# EAGLE design SeniorDesignTest (EAGLE 7.0.0)
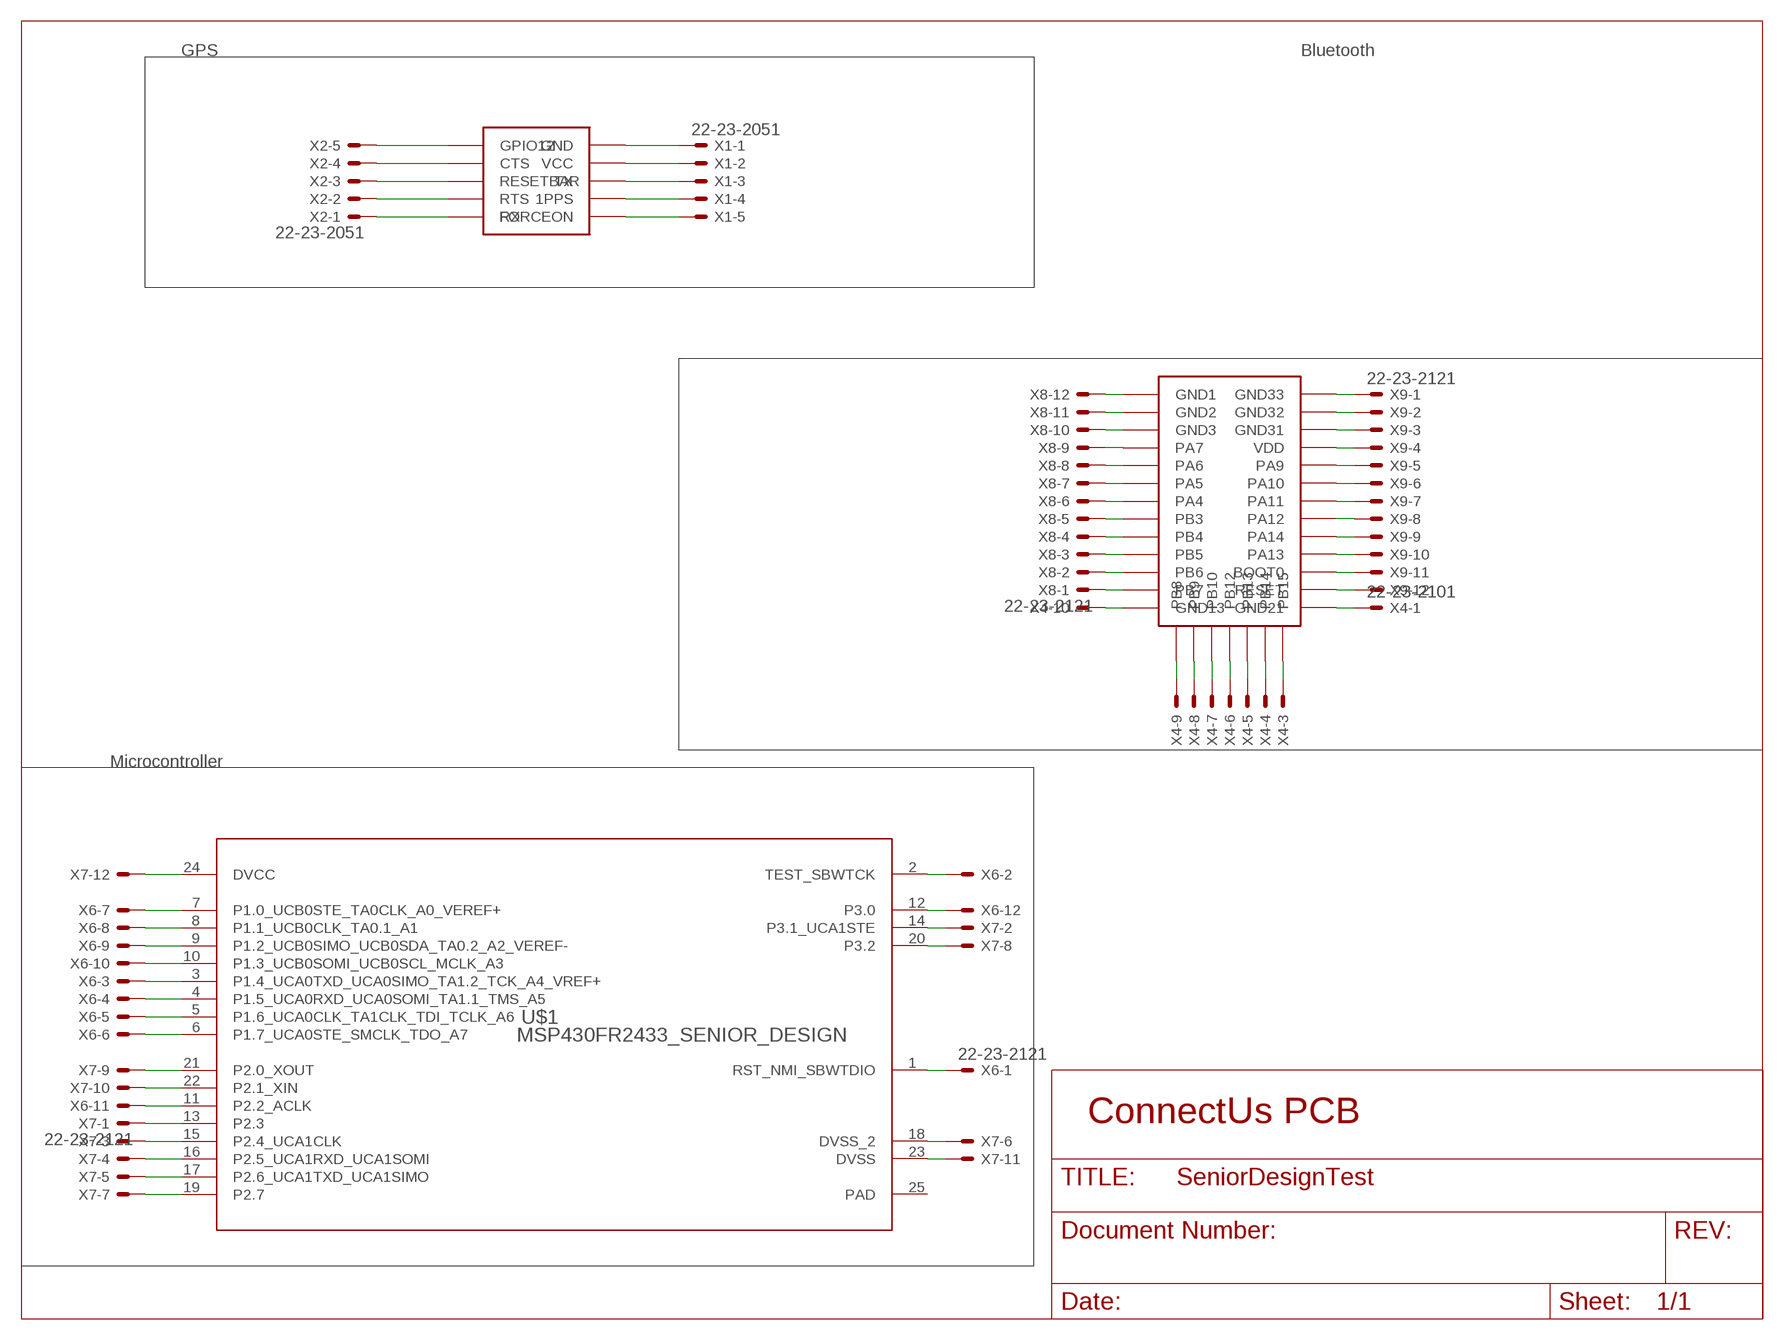
[diagram p0: schematic, sheet 1]

## Parts
GPS(ORG1510)  ORG1510  [ORG1510]
U$1  MSP430FR2433_SENIOR_DESIGN  [RGE0024G_NV]
U$2  BT121  [BT121]
X1  22-23-2051  [22-23-2051]
X2  22-23-2051  [22-23-2051]
X4  22-23-2101  [22-23-2101]
X6  22-23-2121  [22-23-2121]
X7  22-23-2121  [22-23-2121]
X8  22-23-2121  [22-23-2121]
X9  22-23-2121  [22-23-2121]

## Nets
N$1: U$1.24(DVCC) X7.12
N$2: U$1.7(P1.0_UCB0STE_TA0CLK_A0_VEREF+) X6.7
N$3: U$1.8(P1.1_UCB0CLK_TA0.1_A1) X6.8
N$4: U$1.9(P1.2_UCB0SIMO_UCB0SDA_TA0.2_A2_VEREF-) X6.9
N$5: U$2.PB3 X8.5
N$6: U$1.10(P1.3_UCB0SOMI_UCB0SCL_MCLK_A3) X6.10
N$7: U$1.3(P1.4_UCA0TXD_UCA0SIMO_TA1.2_TCK_A4_VREF+) X6.3
N$8: U$1.4(P1.5_UCA0RXD_UCA0SOMI_TA1.1_TMS_A5) X6.4
N$9: U$1.5(P1.6_UCA0CLK_TA1CLK_TDI_TCLK_A6) X6.5
N$10: U$1.6(P1.7_UCA0STE_SMCLK_TDO_A7) X6.6
N$11: U$2.PB4 X8.4
N$12: U$1.21(P2.0_XOUT) X7.9
N$13: U$1.22(P2.1_XIN) X7.10
N$14: U$1.11(P2.2_ACLK) X6.11
N$15: U$1.13(P2.3) X7.1
N$16: U$2.PB5 X8.3
N$17: U$1.15(P2.4_UCA1CLK) X7.3
N$18: U$1.16(P2.5_UCA1RXD_UCA1SOMI) X7.4
N$19: U$1.17(P2.6_UCA1TXD_UCA1SIMO) X7.5
N$20: U$1.19(P2.7) X7.7
N$21: U$1.2(TEST_SBWTCK) X6.2
N$22: U$1.12(P3.0) X6.12
N$23: U$1.14(P3.1_UCA1STE) X7.2
N$24: U$1.20(P3.2) X7.8
N$25: U$1.1(RST_NMI_SBWTDIO) X6.1
N$26: U$1.18(DVSS_2) X7.6
N$27: U$1.23(DVSS) X7.11
N$28: U$2.GND1 X8.12
N$29: U$2.GND2 X8.11
N$30: U$2.GND3 X8.10
N$31: U$2.PA7 X8.9
N$32: U$2.PA6 X8.8
N$33: U$2.PA5 X8.7
N$34: U$2.PA4 X8.6
N$35: U$2.PB6 X8.2
N$36: U$2.PB7 X8.1
N$37: U$2.GND13 X4.10
N$38: U$2.PA12 X9.8
N$39: U$2.PA14 X9.9
N$40: U$2.PA13 X9.10
N$41: U$2.GND33 X9.1
N$42: U$2.GND32 X9.2
N$43: U$2.GND31 X9.3
N$44: U$2.VDD X9.4
N$45: U$2.PA9 X9.5
N$46: U$2.PA10 X9.6
N$47: U$2.PA11 X9.7
N$48: U$2.BOOT0 X9.11
N$49: U$2.RESET X9.12
N$50: U$2.GND21 X4.1
N$54: U$2.PB8 X4.9
N$55: U$2.PB9 X4.8
N$56: U$2.PB10 X4.7
N$57: U$2.PB12 X4.6
N$58: U$2.PB13 X4.5
N$59: U$2.PB14 X4.4
N$60: U$2.PB15 X4.3
N$61: GPS(ORG1510).GPIO12 X2.5
N$62: GPS(ORG1510).CTS X2.4
N$63: GPS(ORG1510).RESETBAR X2.3
N$64: GPS(ORG1510).RTS X2.2
N$65: GPS(ORG1510).GND X1.1
N$66: GPS(ORG1510).VCC X1.2
N$67: GPS(ORG1510).TX X1.3
N$68: GPS(ORG1510).1PPS X1.4
N$69: GPS(ORG1510).FORCEON X1.5
RX: GPS(ORG1510).RX X2.1
Unconnected: X4.2

## Notes on the sheet
- GPS | Bluetooth
- Microcontroller
- ConnectUs PCB

## Power pins joined to a net without a drawn wire
PAD: U$1.25(PAD)

## Library data of the parts
GPS(ORG1510) = MyLib:ORG1510
U$1 = MSP430FR2533:MSP430FR2433_SENIOR_DESIGN
U$2 = MyLib:BT121
X1 X2 = con-molex:22-23-2051: .100" (2.54mm) Center Header - 5 Pin; MF: MOLEX; MPN: 22-23-2051; OC_FARNELL: 1462952; OC_NEWARK: 38C9178
X4 = con-molex:22-23-2101: .100" (2.54mm) Center Header - 10 Pin; MF: MOLEX; MPN: 22-23-2101; OC_FARNELL: 1756828; OC_NEWARK: 94C0765
X6-X9 = con-molex:22-23-2121: .100" (2.54mm) Center Header - 12 Pin; MF: MOLEX; MPN: 22-23-2121; OC_FARNELL: 1462935; OC_NEWARK: 56H0456

## Board
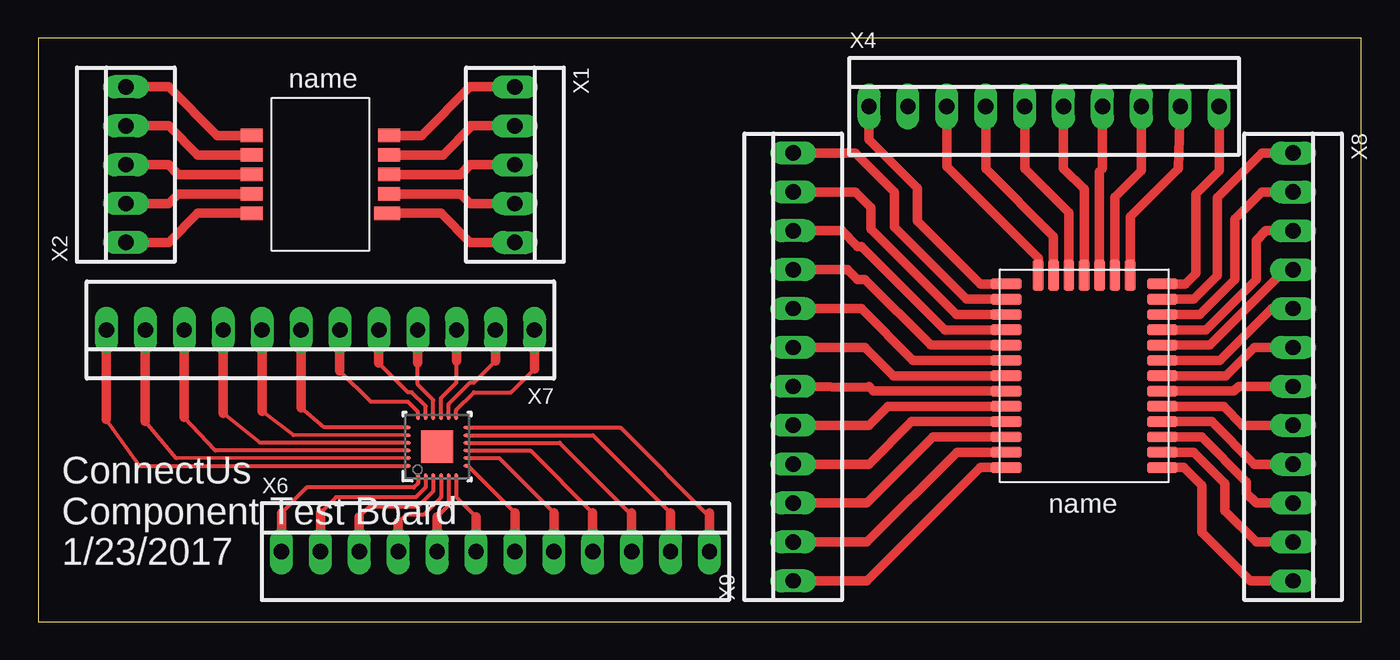
[diagram p1: board, top side]
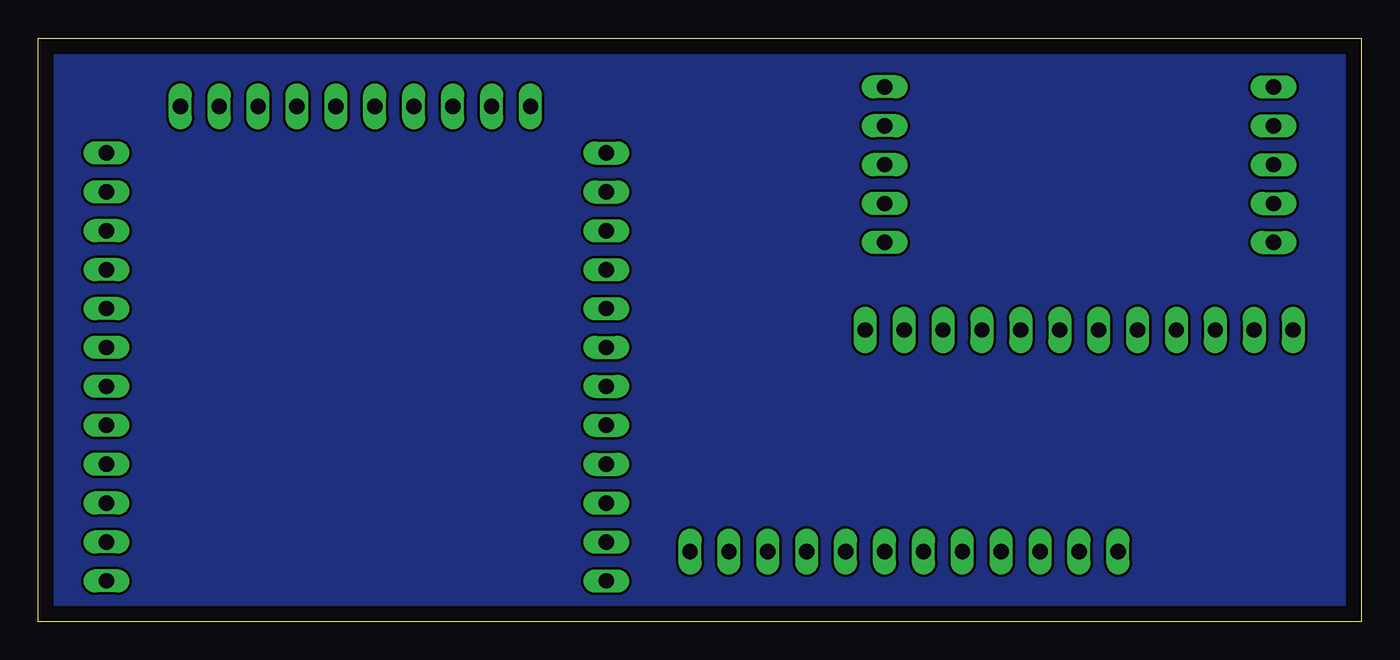
[diagram p2: board, bottom side, seen from below]

Size 86.36 x 38.1 mm. Coordinates in mm from the lower left corner, seen from the top.
Outline: 0,0 86.36,0 86.36,38.1 0,38.1 0,0
Copper layers (1*16): Top 0.035mm / dielectric 1.5mm / Bottom 0.035mm
Design rules "AdvancedCircuitsBarebones *": minimum track width 6mil, minimum drill 15mil, track to track 6mil, track to pad 6mil, pad to pad 6mil, via to via 6mil, smd to smd 0mil, copper to edge 40mil, drill to drill 6mil, minimum pad ring 10mil, minimum via ring 8mil, stop-mask expansion 4mil, vias tented up to drill 15mil, thermal gap 10mil

### Footprints (pad centres in the part's own frame; a part is rotated, then mirrored left to right if it is on the bottom)
ORG1510 = smd 1.422 x 0.864: 1PPS 4.485,-1.27; CTS -4.485,1.27; GND 4.485,2.54; GPIO12 -4.485,2.54; RESETBAR -4.485,0; RTS -4.485,-1.27; RX -4.485,-2.54; TX 4.485,0; VCC 4.485,1.27 | smd 1.676 x 0.864: FORCEON 4.358,-2.54
RGE0024G_NV = smd 0.36 x 0.24: 1 -1.9,1.25; 2 -1.9,0.75; 3 -1.9,0.25; 4 -1.9,-0.25; 5 -1.9,-0.75; 6 -1.9,-1.25; 13 1.9,-1.25; 14 1.9,-0.75; 15 1.9,-0.25; 16 1.9,0.25; 17 1.9,0.75; 18 1.9,1.25 | smd 0.24 x 0.36: 7 -1.25,-1.9; 8 -0.75,-1.9; 9 -0.25,-1.9; 10 0.25,-1.9; 11 0.75,-1.9; 12 1.25,-1.9; 19 1.25,1.9; 20 0.75,1.9; 21 0.25,1.9; 22 -0.25,1.9; 23 -0.75,1.9; 24 -1.25,1.9 | smd 2.1 x 2.1: 25 0,0
BT121 = smd 2 x 0.7: BOOT0 5.1,2.95; GND1 -5.1,12.95; GND2 -5.1,11.95; GND3 -5.1,10.95; GND13 -5.1,0.95; GND21 5.1,0.95; GND31 5.1,10.95; GND32 5.1,11.95; GND33 5.1,12.95; PA4 -5.1,6.95; PA5 -5.1,7.95; PA6 -5.1,8.95; PA7 -5.1,9.95; PA9 5.1,8.95; PA10 5.1,7.95; PA11 5.1,6.95; PA12 5.1,5.95; PA13 5.1,3.95; PA14 5.1,4.95; PB3 -5.1,5.95; PB4 -5.1,4.95; PB5 -5.1,3.95; PB6 -5.1,2.95; PB7 -5.1,1.95; RESET 5.1,1.95; VDD 5.1,9.95 | smd 0.7 x 2: PB8 -3,0.4; PB9 -2,0.4; PB10 -1,0.4; PB12 0,0.4; PB13 1,0.4; PB14 2,0.4; PB15 3,0.4
22-23-2051 = drill 1 long: 1 -5.08,0; 2 -2.54,0; 3 0,0; 4 2.54,0; 5 5.08,0
22-23-2101 = drill 1 long: 1 -11.43,0; 2 -8.89,0; 3 -6.35,0; 4 -3.81,0; 5 -1.27,0; 6 1.27,0; 7 3.81,0; 8 6.35,0; 9 8.89,0; 10 11.43,0
22-23-2121 = drill 1 long: 1 -13.97,0; 2 -11.43,0; 3 -8.89,0; 4 -6.35,0; 5 -3.81,0; 6 -1.27,0; 7 1.27,0; 8 3.81,0; 9 6.35,0; 10 8.89,0; 11 11.43,0; 12 13.97,0

### Placement (x,y rotation side)
GPS(ORG1510)  18.41,29.21 0 top
U$1  26.04,11.43 90 top
U$2  68.28,23.01 180 top
X1  31.11,29.84 270 top
X2  5.71,29.84 90 top
X4  65.66,33.66 0 top
X6  29.84,4.57 0 top
X7  18.41,19.05 180 top
X8  81.92,16.64 270 top
X9  49.28,16.64 90 top

### Tracks (layer width: path | path; a pad name or v marks a point on that pad's centre or on a via)
N$1
  Top 0.254: 4.45,13.21 6.6,10.16 U$1.24
  Top 0.61: X7.12 4.45,13.21
N$2
  Top 0.254: 31.11,7.11 28.05,10.18 U$1.7
  Top 0.61: X6.7 31.11,7.11
N$3
  Top 0.254: 33.66,7.11 30.09,10.68 U$1.8
  Top 0.61: X6.8 33.66,7.11
N$4
  Top 0.254: 36.2,7.11 32.13,11.18 U$1.9
  Top 0.61: X6.9 36.2,7.11
N$5
  Top 0.61: U$2.PB3 77.13,17.06 80.52,20.45 X8.5
N$6
  Top 0.254: 38.73,6.99 34.04,11.68 U$1.10
  Top 0.61: X6.10 38.73,6.99 38.73,7.11
N$7
  Top 0.254: 20.95,6.86 21.59,7.49 24.77,7.49 25.79,8.51 U$1.3
  Top 0.61: X6.3 20.95,6.86
N$8
  Top 0.254: 23.5,6.48 24,6.99 25.15,6.99 26.29,8.12 U$1.4
  Top 0.61: X6.4 23.5,6.48
N$9
  Top 0.254: 26.04,6.86 26.79,7.61 U$1.5
  Top 0.61: X6.5 26.04,6.86
N$10
  Top 0.254: 28.57,6.86 27.29,8.15 U$1.6
  Top 0.61: X6.6 28.57,6.86
N$11
  Top 0.61: U$2.PB4 76.48,18.06 81.41,22.99 X8.4
N$12
  Top 0.254: 12.06,13.59 14.48,11.68 U$1.21
  Top 0.61: X7.9 12.06,13.59
N$13
  Top 0.254: 9.53,13.34 11.56,11.18 U$1.22
  Top 0.61: X7.10 9.53,13.34
N$14
  Top 0.254: 41.27,7.11 36.21,12.18 U$1.11
  Top 0.61: X6.11 41.27,7.11
N$15
  Top 0.254: 32.38,16.51 30.86,14.99 28.45,14.99 27.29,13.82 U$1.13
  Top 0.61: X7.1 32.38,16.51
N$16
  Top 0.61: U$2.PB5 76.21,19.06 79.5,22.35 79.5,24.89 80.14,25.53 X8.3
N$17
  Top 0.254: 27.3,17.02 27.3,15.62 26.29,14.6 U$1.15
  Top 0.61: X7.3 27.3,17.02
N$18
  Top 0.254: 24.77,16.89 24.77,15.49 25.79,14.47 U$1.16
  Top 0.61: X7.4 24.77,16.89
N$19
  Top 0.254: 22.23,16.89 24.13,14.99 24.38,14.99 25.29,14.09 U$1.17
  Top 0.61: X7.5 22.23,16.89
N$20
  Top 0.254: 17.14,13.97 18.67,12.7 U$1.19
  Top 0.61: X7.7 17.14,13.97
N$21
  Top 0.254: 18.41,7.11 19.43,8.13 24.64,8.13 25.29,8.78 U$1.2
  Top 0.61: X6.2 18.41,7.11
N$22
  Top 0.254: 43.81,6.86 37.99,12.68 U$1.12
  Top 0.61: X6.12 43.81,6.86 43.81,7.11
N$23
  Top 0.254: 29.84,17.02 28.45,15.62 28.19,15.62 26.79,14.21 U$1.14
  Top 0.61: X7.2 29.84,17.02
N$24
  Top 0.254: 14.6,13.74 16.64,12.19 U$1.20
  Top 0.61: X7.8 14.6,13.74
N$25
  Top 0.254: 15.88,7.11 17.53,8.76 24.51,8.76 24.79,9.04 U$1.1
  Top 0.61: X6.1 15.88,7.11
N$26
  Top 0.254: 19.68,16.38 21.72,14.35 24.13,14.35 24.79,13.7 U$1.18
  Top 0.61: X7.6 19.68,16.38
N$27
  Top 0.254: 6.99,13.08 9.02,10.67 U$1.23
  Top 0.61: X7.11 6.99,13.08
N$28
  Top 0.61: U$2.GND1 74.77,10.06 75.95,8.89 75.95,5.84 79.12,2.67 X8.12
N$29
  Top 0.61: U$2.GND2 75.42,11.06 77.47,9.02 77.47,7.24 79.5,5.21 X8.11
N$30
  Top 0.61: U$2.GND3 75.95,12.06 78.87,9.14 78.87,8.38 79.5,7.75 X8.10
N$31
  Top 0.61: U$2.PA7 76.6,13.06 79.38,10.29 X8.9
N$32
  Top 0.61: U$2.PA6 77.38,14.06 78.61,12.83 X8.8
N$33
  Top 0.61: U$2.PA5 78.05,15.06 78.36,15.37 X8.7
N$34
  Top 0.61: U$2.PA4 77.53,16.06 79.38,17.91 X8.6
N$35
  Top 0.61: U$2.PB6 75.81,20.06 78.11,22.35 78.11,26.29 79.88,28.07 X8.2
N$36
  Top 0.61: U$2.PB7 75.42,21.06 76.96,22.61 76.96,27.69 79.88,30.61 X8.1
N$37
  Top 0.61: U$2.GND13 74.89,22.06 75.56,22.73 75.56,27.94 77.09,29.46 X4.10
N$38
  Top 0.61: U$2.PA12 57.11,17.06 53.72,20.45 X9.8
N$39
  Top 0.61: U$2.PA14 58.27,18.06 53.98,22.35 53.47,22.35 52.83,22.99 X9.9
N$40
  Top 0.61: U$2.PA13 59.17,19.06 53.72,24.51 53.47,24.51 52.45,25.53 X9.10
N$41
  Top 0.61: U$2.GND33 61.5,10.06 54.1,2.67 X9.1
N$42
  Top 0.61: U$2.GND32 59.96,11.06 54.1,5.21 X9.2
N$43
  Top 0.61: U$2.GND31 58.42,12.06 54.1,7.75 X9.3
N$44
  Top 0.61: U$2.VDD 57,13.06 54.23,10.29 X9.4
N$45
  Top 0.61: U$2.PA9 55.46,14.06 54.23,12.83 X9.5
N$46
  Top 0.61: U$2.PA10 54.53,15.06 54.29,15.3 | 54.29,15.3 54.23,15.37 | X9.6 54.29,15.3
N$47
  Top 0.61: U$2.PA11 55.82,16.06 53.98,17.91 X9.7
N$48
  Top 0.61: U$2.BOOT0 59.95,20.06 54.36,25.65 54.36,27.05 53.34,28.07 X9.11
N$49
  Top 0.61: U$2.RESET 60.6,21.06 55.88,25.78 55.88,28.07 53.34,30.61 X9.12
N$50
  Top 0.61: U$2.GND21 61.5,22.06 57.4,26.16 57.4,28.32 54.23,31.5 X4.1
N$54
  Top 0.61: U$2.PB8 71.28,26.44 74.42,29.59 X4.9
N$55
  Top 0.61: U$2.PB9 70.28,27.73 72.01,29.46 X4.8
N$56
  Top 0.61: U$2.PB10 69.28,29.4 69.47,29.59 X4.7
N$57
  Top 0.61: U$2.PB12 68.28,28.25 66.93,29.59 X4.6
N$58
  Top 0.61: U$2.PB13 67.28,26.7 64.39,29.59 X4.5
N$59
  Top 0.61: U$2.PB14 66.28,25.16 61.85,29.59 X4.4
N$60
  Top 0.61: U$2.PB15 65.28,23.75 59.31,29.72 X4.3
N$61
  Top 0.61: X2.5 8.51,34.92 11.68,31.75 GPS(ORG1510).GPIO12
N$62
  Top 0.61: X2.4 8.51,32.38 10.41,30.48 GPS(ORG1510).CTS
N$63
  Top 0.61: X2.3 8.51,29.84 9.14,29.21 GPS(ORG1510).RESETBAR
N$64
  Top 0.61: X2.2 8.51,27.3 9.14,27.94 GPS(ORG1510).RTS
N$65
  Top 0.61: X1.1 28.19,34.92 25.02,31.75 GPS(ORG1510).GND
N$66
  Top 0.61: X1.2 28.32,32.38 | 28.32,32.38 28.19,32.38 | GPS(ORG1510).VCC 26.42,30.48 28.32,32.38
N$67
  Top 0.61: X1.3 28.19,29.84 27.56,29.21 GPS(ORG1510).TX
N$68
  Top 0.61: X1.4 28.19,27.3 27.56,27.94 GPS(ORG1510).1PPS
N$69
  Top 0.61: X1.5 28.19,24.77 26.29,26.67 GPS(ORG1510).FORCEON
RX
  Top 0.61: X2.1 8.51,24.77 10.41,26.67 GPS(ORG1510).RX
VSS
  pour Bottom (no thermals): 0,0 86.64,0 85.75,37.75 0,37.75

### Text on the board
tNames: ConnectUs / Component Test Board / 1/23/2017